# Altium schematic sheet Diagram.SchDoc
size A
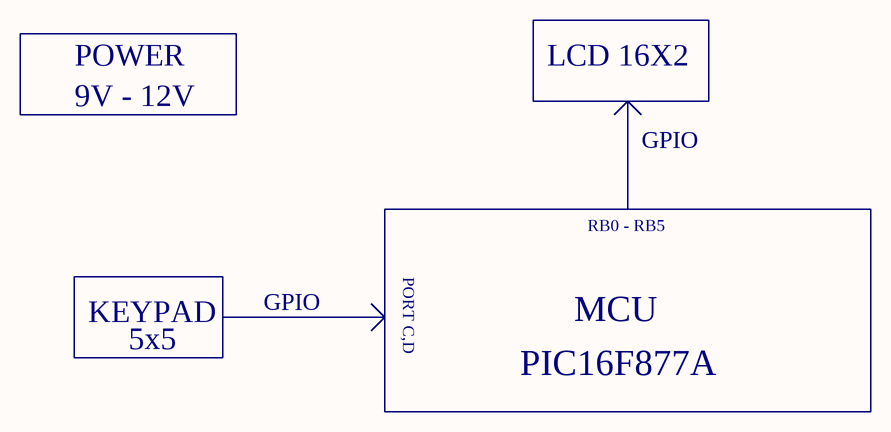
[diagram p0: Diagram.SchDoc]

## Notes on the sheet
- POWER
- 9V - 12V
- LCD 16X2
- GPIO
- RB0 - RB5
- KEYPAD
- PORT C,D
- MCU
- 5x5
- PIC16F877A